# EAGLE design modularduino (EAGLE 5.04)
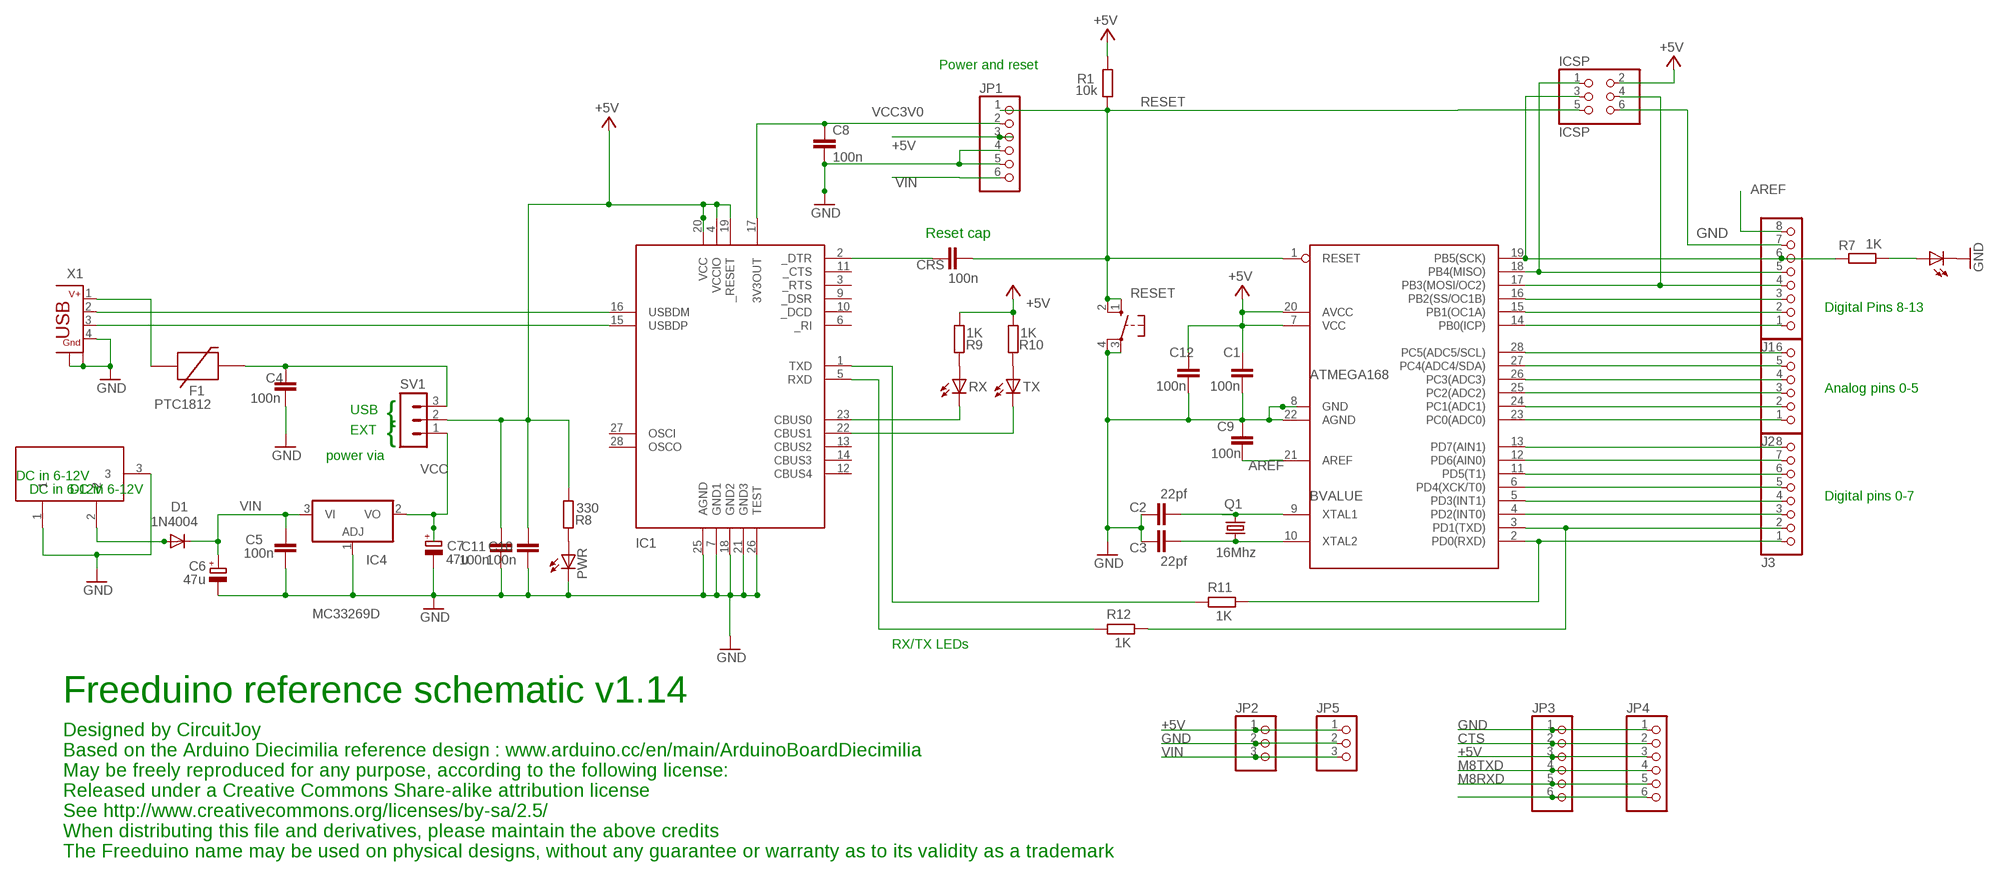
[diagram p0: schematic, sheet 1]

## Parts
BVALUE  ATMEGA168  MEGA8-P  [DIL28-3]
C1  100n  C-EUC1206  [C1206]
C2  22pf  C-EUC1206  [C1206]
C3  22pf  C-EUC1206  [C1206]
C4  100n  C-EUC1206  [C1206]
C5  100n  C-EUC1206  [C1206]
C6  47u  CPOL-EUD  [PANASONIC_D]
C7  47u  CPOL-EUD  [PANASONIC_D]
C8  100n  C-EUC1206  [C1206]
C9  100n  C-EUC1206  [C1206]
C10  100n  C-EUC1206  [C1206]
C11  100n  C-EUC1206  [C1206]
C12  100n  C-EUC1206  [C1206]
CRS  100n  C-EUC1206  [C1206]
D1  1N4004  DIODESMA  [SMA-DIODE]
DC1  9V in  DC21MMX  [DC-21MM]
F1  PTC1812  [C1812]
IC1  FT232RL  FT232RL-PINNED  [SSOP28DB]
IC4  MC33269D  [DPACK]
ICSP  ICSP  PINHD-2X3  [2X03]
J1  PINHD-1X8  [1X08]
J2  PINHD-1X6  [1X06]
J3  PINHD-1X8  [1X08]
JP1  PINHD-1X6  [1X06]
JP2  PINHD-1X3  [1X03]
JP3  PINHD-1X6  [1X06]
JP4  PINHD-1X6  [1X06]
JP5  PINHD-1X3  [1X03]
P13  LED-LCC1206  [LCC1206]
PWR  LED-LCC1206  [LCC1206]
Q1  16Mhz  CRYSTALHC49U-V  [HC49U-V]
R1  10k  R-EU_R1206  [R1206]
R7  1K  R-EU_R1206  [R1206]
R8  330  R-EU_R1206  [R1206]
R9  1K  R-EU_R1206  [R1206]
R10  1K  R-EU_R1206  [R1206]
R11  1K  R-EU_R1206  [R1206]
R12  1K  R-EU_R1206  [R1206]
RESET  10-XX  [B3F-10XX]
RX  LED-LCC1206  [LCC1206]
SV1  MA03-1  [MA03-1]
TX  LED-LCC1206  [LCC1206]
X1  CON-USB-B  [USB-WSHIELDPADS]

## Nets
+5V [power]: BVALUE.7(VCC) BVALUE.20(AVCC) C1.1 C10.2 C11.2 C12.1 IC1.4(VCCIO) IC1.19(_RESET) IC1.20(VCC) ICSP.2 JP1.3 JP2.1 JP3.3 JP4.3 JP5.1 R1.2 R8.1 R9.1 R10.1 SV1.2
AREF: BVALUE.21(AREF) C9.1 J1.8
CRS [finepitch]: CRS.1 IC1.2(_DTR) JP3.6 JP4.6
CTS: JP3.2 JP4.2
GND [power]: BVALUE.8(GND) BVALUE.22(AGND) C1.2 C2.1 C3.1 C4.1 C5.1 C6.- C7.- C8.2 C9.2 C10.1 C11.1 C12.2 DC1.1 DC1.3 IC1.7(GND1) IC1.18(GND2) IC1.21(GND3) IC1.25(AGND) IC1.26(TEST) IC4.1(ADJ) ICSP.6 J1.7 JP1.4 JP1.5 JP2.2 JP3.1 JP4.1 JP5.2 P13.C PWR.C RESET.3(P) RESET.4(P1) X1.4 X1.SH1(GND) X1.SH2(GND)
M8RXD [finepitch]: IC1.1(TXD) JP3.5 JP4.5 R11.1
M8TXD [finepitch]: IC1.5(RXD) JP3.4 JP4.4 R12.1
N$2: BVALUE.15(PB1(OC1A)) J1.2
N$3: PWR.A R8.2
N$5 [finepitch]: IC1.23(CBUS0) RX.C
N$6: BVALUE.9(XTAL1) C2.2 Q1.2
N$7 [power]: C4.2 F1.2 SV1.3
N$9 [finepitch]: IC1.16(USBDM) X1.2
N$10: BVALUE.4(PD2(INT0)) J3.3
N$11: BVALUE.5(PD3(INT1)) J3.4
N$12: BVALUE.6(PD4(XCK/T0)) J3.5
N$13: BVALUE.11(PD5(T1)) J3.6
N$14: BVALUE.12(PD6(AIN0)) J3.7
N$15: BVALUE.13(PD7(AIN1)) J3.8
N$16: BVALUE.23(PC0(ADC0)) J2.1
N$17: BVALUE.24(PC1(ADC1)) J2.2
N$18: BVALUE.25(PC2(ADC2)) J2.3
N$19: BVALUE.26(PC3(ADC3)) J2.4
N$20: BVALUE.27(PC4(ADC4/SDA)) J2.5
N$21: BVALUE.28(PC5(ADC5/SCL)) J2.6
N$22: BVALUE.3(PD1(TXD)) J3.2 R12.2
N$23: BVALUE.16(PB2(SS/OC1B)) J1.3
N$24 [finepitch]: IC1.15(USBDP) X1.3
N$26: BVALUE.18(PB4(MISO)) ICSP.1 J1.5
N$28: BVALUE.14(PB0(ICP)) J1.1
N$29 [finepitch]: IC1.22(CBUS1) TX.C
N$31: BVALUE.10(XTAL2) C3.2 Q1.1
N$32: P13.A R7.1
N$34: R10.2 TX.A
N$36: R9.2 RX.A
N$43: BVALUE.17(PB3(MOSI/OC2)) ICSP.4 J1.4
N$44: BVALUE.2(PD0(RXD)) J3.1 R11.2
N$45: D1.A DC1.2
RESET: BVALUE.1(RESET) CRS.2 ICSP.5 JP1.1 R1.1 RESET.1(S) RESET.2(S1)
SCK: BVALUE.19(PB5(SCK)) ICSP.3 J1.6 R7.2
USBV+ [power]: F1.1 X1.1
VCC [power]: C7.+ IC4.2(VO) SV1.1
VCC3V0 [power]: C8.1 IC1.17(3V3OUT) JP1.2
VIN [power]: C5.2 C6.+ D1.C IC4.3(VI) JP1.6 JP2.3 JP5.3
Unconnected: IC1.3(_RTS) IC1.6(_RI) IC1.9(_DSR) IC1.10(_DCD) IC1.11(_CTS) IC1.12(CBUS4) IC1.13(CBUS2) IC1.14(CBUS3) IC1.27(OSCI) IC1.28(OSCO)

## Notes on the sheet
- Power and reset
- Reset cap
- Digital Pins 8-13
- Analog pins 0-5
- USB
- {
- EXT
- {
- power via
- DC in 6-12V
- DC in 6-12V | DC in 6-12V
- Digital pins 0-7
- RX/TX LEDs
- Freeduino reference schematic v1.14
- Designed by CircuitJoy
- Based on the Arduino Diecimilia reference design : www.arduino.cc/en/main/ArduinoBoardDiecimilia
- May be freely reproduced for any purpose, according to the following license:
- Released under a Creative Commons Share-alike attribution license
- See http://www.creativecommons.org/licenses/by-sa/2.5/
- When distributing this file and derivatives, please maintain the above credits
- The Freeduino name may be used on physical designs, without any guarantee or warranty as to its validity as a trademark

## Library data of the parts
BVALUE = my-library:MEGA8-P: MICROCONTROLLER 8 Kbytes FLASH 1 kbytes SRAM 512 bytes EEPROM USART 4-channel 10 bit ADC 2-channel 8 bit ADC Source: avr.lbr
C1-C5 C8-C12 CRS = rcl:C-EU: CAPACITOR, European symbol
C6 C7 = rcl:CPOL-EU: POLARIZED CAPACITOR, European symbol
D1 = SparkFunEagle-6-6-07:DIODE: Diode These are standard reverse protection diodes and small signal diodes. SMA package can handle up to about 1A. SOD-323 can handle about 200mA. What the SOD-323 package when ordering, there are some mfgs out there that are 5-pin packages.
DC1 = powersupply:DC21MM
F1 = SparkFunEagle-6-6-07:PTC: Resettable Fuse PTC Resettable Fuse. Spark Fun Electronics SKU : COM-08357
IC1 = my-library:FT232RL-PINNED: USB UART FT232RL 4th Generation USB UART (USB <-> Serial) Controller. Spark Fun Electronics SKU : COM-00650
IC4 = linear:MC33269?*: Adjustable Output Low Dropout Voltage Regulator 800 mA Source: http://www.onsemi.com/pub/Collateral/MC33269-D.PDF
ICSP = pinhead:PINHD-2X3: PIN HEADER
J1 J3 = pinhead:PINHD-1X8: PIN HEADER
J2 JP1 JP3 JP4 = pinhead:PINHD-1X6: PIN HEADER
JP2 JP5 = pinhead:PINHD-1X3: PIN HEADER
P13 PWR RX TX = my-led:LED: LED OSRAM: - CHIPLED LG R971, LG N971, LY N971, LG Q971, LY Q971, LO R971, LY R971 LH N974, LH R974 LS Q976, LO Q976, LY Q976 LO Q996 - Hyper CHIPLED LW Q18S LB Q993, LB Q99A, LB R99A - SideLED LS A670, LO A670, LY A670, LG A670, LP A670 LB A673, LV A673, LT A673, LW A673 LH A674 LY A675 LS A676, LA A676, LO A676, LY A676, LW A676 LS A679, LY A679, LG A679 - Hyper Micro SIDELED® LS Y876, LA Y876, LO Y876, LY Y876 LT Y87S - SmartLED LW L88C, LW L88S LB L89C, LB L89S, LG L890 LS L89K, LO L89K, LY L89K LS L896, LA L896, LO L896, LY L896 - TOPLED LS T670, LO T670, LY T670, LG T670, LP T670 LSG T670, LSP T670, LSY T670, LOP T670, LYG T670 LG T671, LOG T671, LSG T671 LB T673, LV T673, LT T673, LW T673 LH T674 LS T676, LA T676, LO T676, LY T676, LB T676, LH T676, LSB T676, LW T676 LB T67C, LV T67C, LT T67C, LS T67K, LO T67K, LY T67K, LW E67C LS E67B, LA E67B, LO E67B, LY E67B, LB E67C, LV E67C, LT E67C LW T67C LS T679, LY T679, LG T679 LS T770, LO T770, LY T770, LG T770, LP T770 LB T773, LV T773, LT T773, LW T773 LH T774 LS E675, LA E675, LY E675, LS T675 LS T776, LA T776, LO T776, LY T776, LB T776 LHGB T686 LT T68C, LB T68C - Hyper Mini TOPLED® LB M676 - Mini TOPLED Santana® LG M470 LS M47K, LO M47K, LY M47K Source: http://www.osram.convergy.de/
Q1 = crystal:CRYSTAL: CRYSTAL
R1 R7-R12 = rcl:R-EU_: RESISTOR, European symbol
RESET = switch-omron:10-XX: OMRON SWITCH
SV1 = con-lstb:MA03-1: PIN HEADER
X1 = mylib4:CON-USB-B: BERG USB connector

## Net classes
0 default: width 0.254 mm, clearance 0.203 mm
1 power: width 0.508 mm, clearance 0.305 mm
2 finepitch: width 0.203 mm, clearance 0.203 mm

## Board
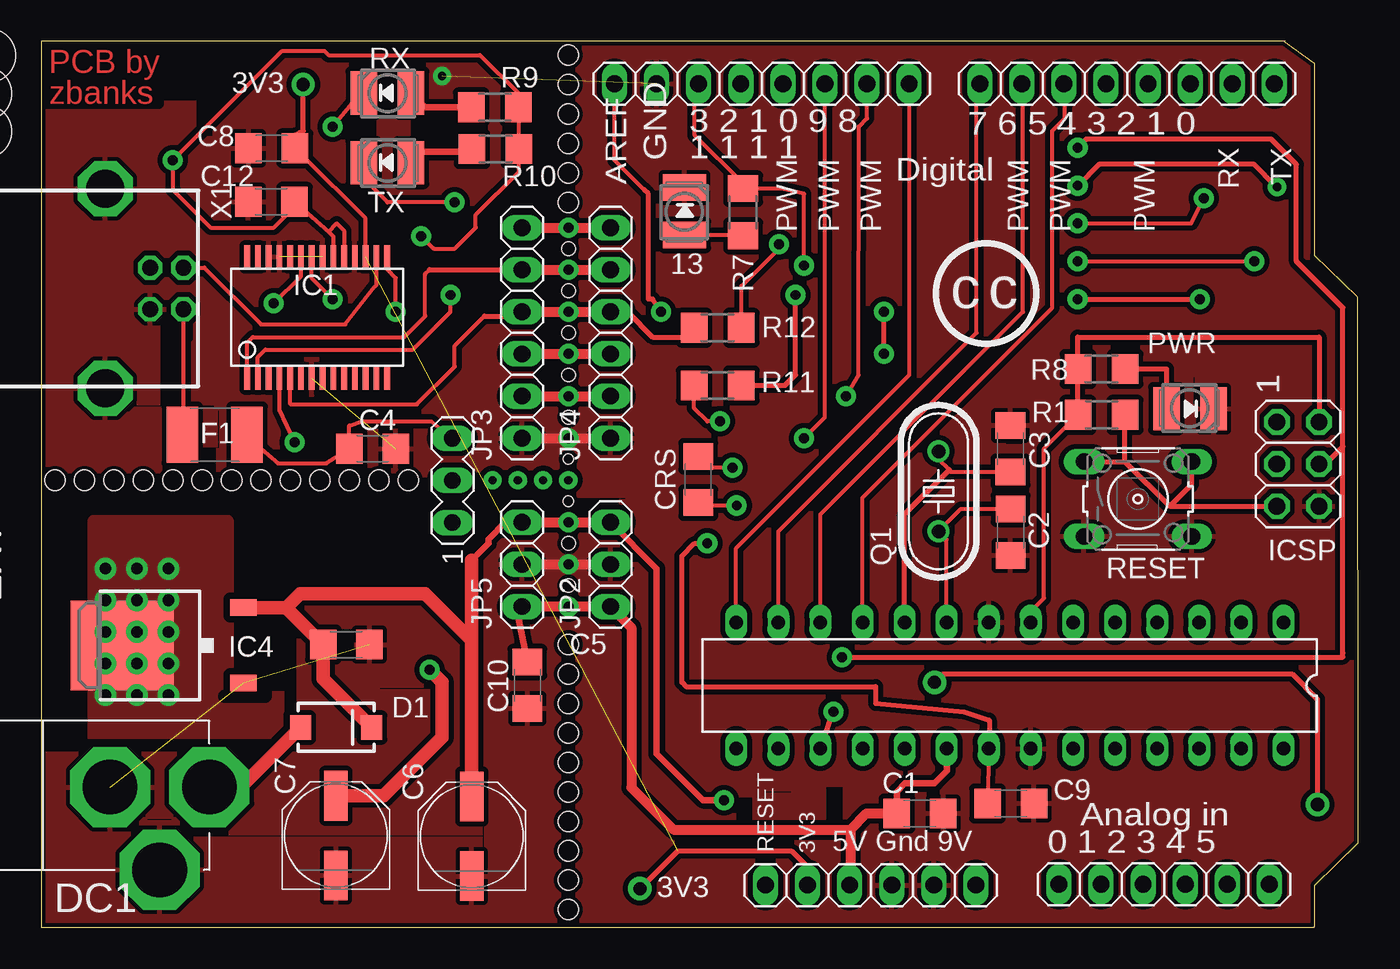
[diagram p1: board, top side]
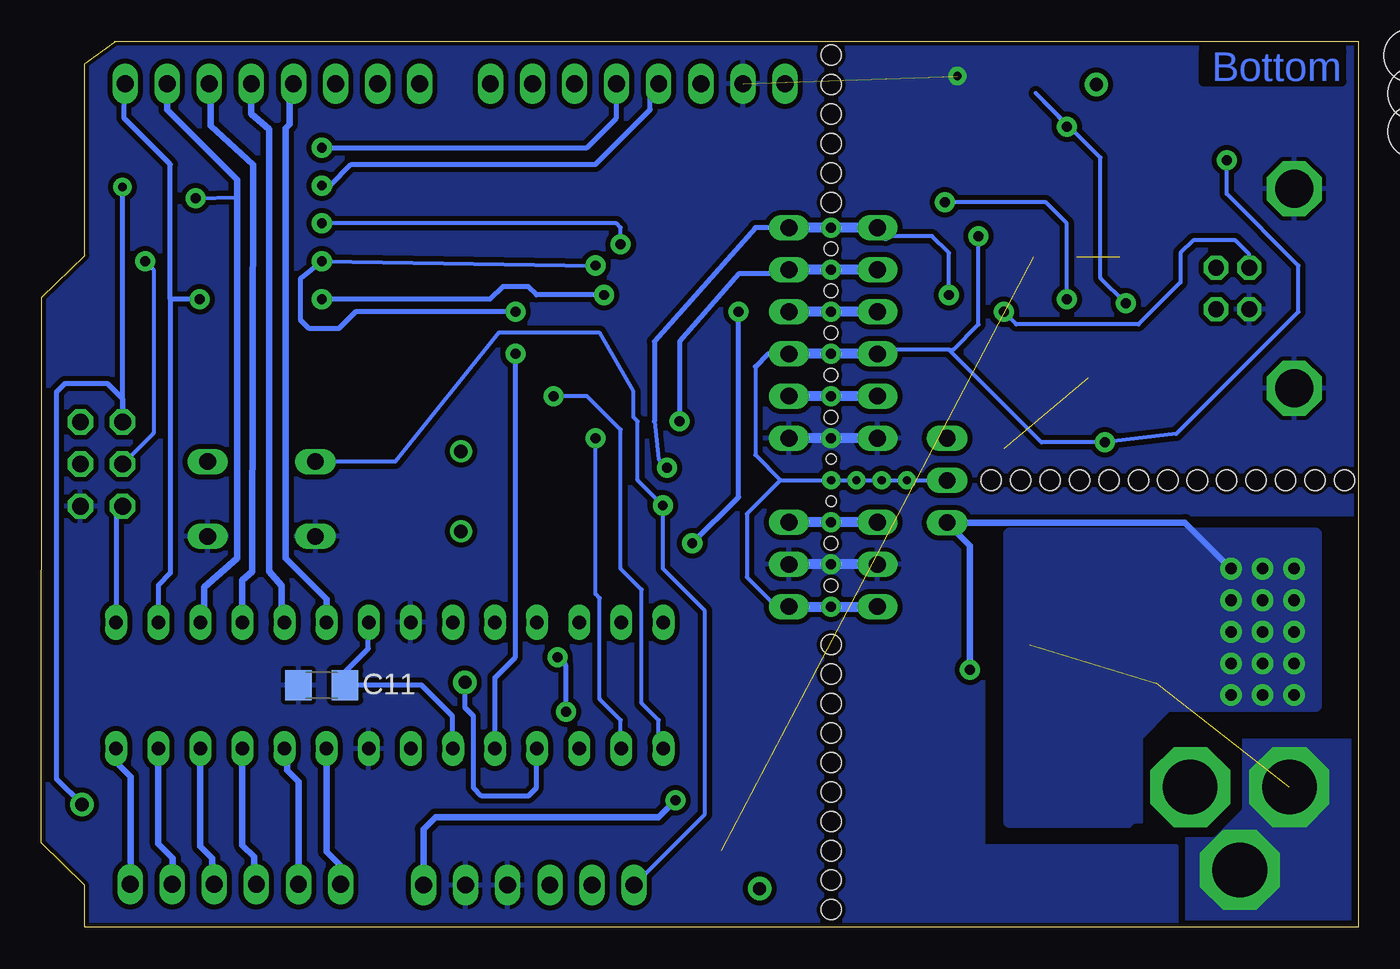
[diagram p2: board, bottom side, seen from below]

Size 79.46 x 53.44 mm. Coordinates in mm from the lower left corner, seen from the top.
Outline: 76.84,0.03 76.85,0.06 76.85,2.55 79.46,5.1
Outline: 76.85,40.54 76.85,52.09 75.02,53.44
Outline: 76.82,0.05 76.83,0 74.26,0.01 0,0.01 0,53.44 75.08,53.44
Outline: 79.46,5.11 79.45,38 76.8,40.54
Copper layers (1*16): Top 0.035mm / dielectric 1.5mm / Bottom 0.035mm
Design rules "default": minimum track width 10mil, minimum drill 0.6mm, track to track 8mil, track to pad 8mil, pad to pad 8mil, via to via 12mil, smd to smd 8mil, copper to edge 10mil, drill to drill 15mil, minimum pad ring 10mil, minimum via ring 12mil, stop-mask expansion 4mil, vias tented up to drill 0mil, thermal gap 10mil
Holes 3.2 mm at -3.17,52.59 -3.43,50.3 -3.43,48.02
Holes 1.2 mm at 0.81,26.97 2.59,26.97 4.37,26.97 6.15,26.97 7.92,26.97 9.7,26.97 11.48,26.97 13.26,26.97 15.04,26.97 16.81,26.97 18.59,26.97 20.37,26.97 22.15,26.97 31.8,1.06 31.8,2.84 31.8,4.62 31.8,6.4 31.8,8.17 31.8,9.95 31.8,11.73 31.8,13.51 31.8,15.29 31.8,17.06 31.8,43.73 31.8,45.51 31.8,47.29 31.8,49.07 31.8,50.85 31.8,52.62
Holes 0.8 mm at 31.8,20.62 31.8,23.16 31.8,40.94 31.8,38.4 31.8,35.86 31.8,33.32 31.8,30.78
Holes 0.6 mm at 31.8,25.7 31.8,28.24
tRestrict: area 26.8,41.2 to 27.8,43.1; area 26.9,23.8 to 27.8,25.7; area 33.9,23.7 to 34.8,25.6; area 19.3,46.8 to 20.2,48.7; area 9.4,47.7 to 10.3,49.7; area 58.2,29.2 to 59.2,31.1; area 13.1,14.7 to 15,15.6; area 14.2,27.9 to 16.1,28.8; area 17.9,16.1 to 18.8,18; area 46.9,28.4 to 48.8,29.4; area 46.9,23.3 to 48.8,24.3; area 47.4,6.5 to 48.3,8.4; 2 more areas; 32 lines
bRestrict: 3 lines

### Footprints (pad centres in the part's own frame; a part is rotated, then mirrored left to right if it is on the bottom)
DIL28-3 = drill 0.813 long: 1 -16.51,-3.81; 2 -13.97,-3.81; 3 -11.43,-3.81; 4 -8.89,-3.81; 5 -6.35,-3.81; 6 -3.81,-3.81; 7 -1.27,-3.81; 8 1.27,-3.81; 9 3.81,-3.81; 10 6.35,-3.81; 11 8.89,-3.81; 12 11.43,-3.81; 13 13.97,-3.81; 14 16.51,-3.81; 15 16.51,3.81; 16 13.97,3.81; 17 11.43,3.81; 18 8.89,3.81; 19 6.35,3.81; 20 3.81,3.81; 21 1.27,3.81; 22 -1.27,3.81; 23 -3.81,3.81; 24 -6.35,3.81; 25 -8.89,3.81; 26 -11.43,3.81; 27 -13.97,3.81; 28 -16.51,3.81
C1206 = smd 1.6 x 1.8: 1 -1.4,0; 2 1.4,0
PANASONIC_D = smd 3 x 1.4: + 2.4,0; - -2.4,0
SMA-DIODE = smd 1.27 x 1.47: A -2.15,0; C 2.15,0
DC-21MM = drill 3.302 pad 4.826 octagon: 1 -5.08,-3.353; 2 -0.076,-6.35; 3 -0.076,-0.356
C1812 = smd 1.9 x 3.4: 1 -1.95,0; 2 1.95,0
SSOP28DB = smd 0.348 x 1.397: 1 -4.225,-3.656; 2 -3.575,-3.656; 3 -2.925,-3.656; 4 -2.275,-3.656; 5 -1.625,-3.656; 6 -0.975,-3.656; 7 -0.325,-3.656; 8 0.325,-3.656; 9 0.975,-3.656; 10 1.625,-3.656; 11 2.275,-3.656; 12 2.925,-3.656; 13 3.575,-3.656; 14 4.225,-3.656; 15 4.225,3.656; 16 3.575,3.656; 17 2.925,3.656; 18 2.275,3.656; 19 1.625,3.656; 20 0.975,3.656; 21 0.325,3.656; 22 -0.325,3.656; 23 -0.975,3.656; 24 -1.625,3.656; 25 -2.275,3.656; 26 -2.925,3.656; 27 -3.575,3.656; 28 -4.225,3.656
DPACK = smd 1 x 1.6: 1 -2.28,-4.8; 3 2.28,-4.8 | smd 5.4 x 6.2: 2 0,2.5
2X03 = drill 1.016 octagon: 1 -2.54,-1.27; 2 -2.54,1.27; 3 0,-1.27; 4 0,1.27; 5 2.54,-1.27; 6 2.54,1.27
1X08 = drill 1.016 long: 1 -8.89,0; 2 -6.35,0; 3 -3.81,0; 4 -1.27,0; 5 1.27,0; 6 3.81,0; 7 6.35,0; 8 8.89,0
1X06 = drill 1.016 long: 1 -6.35,0; 2 -3.81,0; 3 -1.27,0; 4 1.27,0; 5 3.81,0; 6 6.35,0
1X03 = drill 1.016 long: 1 -2.54,0; 2 0,0; 3 2.54,0
LCC1206 = smd 2.6 x 1.6: A -0.025,1.375; C -0.025,-1.475
HC49U-V = drill 0.813 round: 1 -2.413,0; 2 2.413,0
R1206 = smd 1.6 x 1.803: 1 -1.422,0; 2 1.422,0
B3F-10XX = drill 1.016 long: 1 -3.251,2.261; 2 3.251,2.261; 3 -3.251,-2.261; 4 3.251,-2.261
MA03-1 = drill 1.016 long: 1 -2.54,0; 2 0,0; 3 2.54,0
USB-WSHIELDPADS = drill 0.95 octagon: 1 1.25,4.71; 2 -1.25,4.71; 3 -1.25,2.71; 4 1.25,2.71 | drill 2.3 octagon: SH1 -6.02,0; SH2 6.02,0

### Placement (x,y rotation side)
BVALUE  58.44,14.59 180 top
C1  53.02,6.87 0 top
C2  58.49,23.84 90 top
C3  58.48,28.87 270 top
C4  19.98,28.87 180 top
C5  18.4,17.06 180 top
C6  25.97,5.49 90 top
C7  17.77,5.53 90 top
C8  13.9,47 180 top
C9  58.5,7.47 0 top
C10  29.33,14.6 90 top
C11  62.54,14.61 0 bottom
C12  13.88,43.77 180 top
CRS  39.64,27.01 270 top
D1  17.78,12.06 0 top
DC1  3.78,8.54 90 top
F1  10.45,29.71 0 top
IC1  16.64,36.79 0 top
IC4  7.38,17 90 top
ICSP  75.83,27.95 270 top
J1  43.47,50.88 180 top
J2  67.76,2.6 0 top
J3  65.52,50.88 180 top
JP1  50.05,2.55 0 top
JP2  34.34,21.89 90 top
JP3  29.01,35.86 90 top
JP4  34.34,35.86 90 top
JP5  29.01,21.89 90 top
P13  38.8,43.14 180 top
PWR  69.27,31.32 90 top
Q1  54.14,26.3 270 top
R1  63.98,30.92 180 top
R7  42.34,43.14 90 top
R8  63.98,33.68 0 top
R9  27.36,49.47 180 top
R10  27.4,46.95 180 top
R11  40.81,32.69 0 top
R12  40.81,36.17 0 top
RESET  66.17,25.84 0 top
RX  20.92,50.31 270 top
SV1  24.8,26.96 90 top
TX  20.92,46.11 270 top
U$3  [CC-LOGO]  57.91,38.84 0 top
X1  3.86,38.54 270 top

### Tracks (layer width: path | path; a pad name or v marks a point on that pad's centre or on a via)
+5V  (via drill 0.5, 0.6)
  Top 0.254: IC1.20 17.61,41.69 17.33,41.97 | 17.33,41.97 C12.1 15.04,43.78 15.04,43.23 14.02,42.21 10.21,42.21 7.92,44.5 v7.92,46.27 14.53,52.88 17.07,52.88 17.32,52.62 26.47,52.62 28.78,50.31 R9.1 28.78,46.99 28.78,45.54 26.21,42.97 26.21,42.21 24.94,40.94 23.67,40.94 v22.91,41.7 | IC1.19 18.26,42.03 17.83,42.46 | 17.83,42.46 | 17.33,41.97 17.83,42.46 | R1.2 60.5,28.86 60.5,19.86 59.71,19.07 BVALUE.7 | IC1.4 14.36,31.2 v15.29,29.26
  Top 0.305: R1.2 R8.1 62.53,33.68 62.53,35.61 77.1,35.61 ICSP.2
  Top 0.406: 28.78,46.99 R10.1 | 28.71,19.05 C10.2 | C1.1 51.62,8.18 52.12,8.68 53.9,8.68 54.66,9.44 54.66,10.75 BVALUE.20
  Top 0.61: JP3.3 v31.8,34.59 JP4.3 | 28.71,19.05 JP5.1 v31.8,19.35 JP2.1 35.61,18.08 35.61,8.43 38.15,5.89 48.82,5.89 | C1.1 49.8,6.87 48.82,5.89 | 48.82,5.89 48.82,2.59 JP1.3
  Bottom 0.254: v22.91,41.7 22.91,36.37 24.43,34.84 24.69,34.84 | v7.92,46.27 7.92,44.24 3.61,39.92 3.61,37.13 10.97,29.76 v15.29,29.26 19.1,29.26 24.69,34.84 | 24.69,34.84 28.75,34.84 | 36.37,33.83 36.37,28.49 34.85,26.97 | 34.85,26.97 v31.8,26.97 v30.28,26.97 v28.75,26.97 v27.23,26.97 25.07,26.97 SV1.2 | 35.1,19.35 36.88,21.13 36.88,24.94 34.85,26.97
  Bottom 0.305: JP4.3 35.61,34.59 36.37,33.83 | BVALUE.7 59.74,18.37 59.74,16.81 61.14,15.41 C11.2 56.52,14.61 54.66,12.75 54.66,10.81 BVALUE.20
  Bottom 0.61: JP3.3 v31.8,34.59 | v31.8,34.59 JP4.3 v31.8,34.59 | JP5.1 v31.8,19.35 JP2.1 35.1,19.35 | 28.75,34.84 JP3.3 | JP3.3 v31.8,34.59
AREF  (via drill 0.6)
  Top 0.254: BVALUE.21 C9.1 | J1.8 34.58,46.28 36.37,44.5
  Top 0.305: 36.37,44.5 36.63,44.24 36.63,37.89 36.88,37.89 v37.39,37.13 | v40.18,23.16 39.42,23.16 38.66,22.4 38.66,14.78 38.91,14.52 50.34,14.52 50.34,13.51 55.68,13 57.2,12.49 57.2,10.81 BVALUE.21
  Bottom 0.305: v37.39,37.13 37.39,25.95 v40.18,23.16 | BVALUE.21 56.95,11
CRS  (via drill 0.6)
  Top 0.254: IC1.2 13.06,34.4 13.51,34.84 22.4,34.84 24.69,37.13 v24.69,38.15 | v41.71,27.73 40.32,27.73 CRS.1
  Top 0.61: JP3.6 v31.8,42.21 34.59,42.21
  Bottom 0.254: v24.69,38.15 24.69,40.69 25.7,41.7 28.5,41.7 | 42.47,30.53 42.21,28.24 v41.71,27.73
  Bottom 0.305: JP4.6 36.37,42.21 42.47,35.35 42.47,30.53
  Bottom 0.61: 28.5,41.7 JP3.6 v31.8,42.21 JP4.6
CTS  (via drill 0.6)
  Top 0.61: JP3.2 v31.8,32.05 JP4.2
  Bottom 0.61: JP3.2 v31.8,32.05 JP4.2
GND  (via drill 0.5, 0.6)  (5 unrouted)
  Top 0.61: JP3.1 v31.8,29.51 JP4.1 | JP5.2 v31.8,21.89 JP2.2
  Bottom 0.61: JP3.1 v31.8,29.51 JP4.1 | JP5.2 v31.8,21.89 JP2.2
  other vias: 24.18,51.35
  pour Bottom (isolate 0.4, rank 5, no thermals): -0.64,11.07 10.15,11.07 10.15,-0.83 -0.64,-0.83 -0.64,10.9
  pour Top: -0.2,54.91 81.08,54.91 81.08,-1.73 -0.2,-1.73 -0.2,10.46 15.54,10.46 15.54,25.45 -0.2,25.45
  pour Bottom: -0.2,54.91 81.08,54.91 81.08,-1.73 -0.2,-1.73 -0.2,-0.46 10.97,-0.46 10.97,4.87 22.66,4.87 22.66,24.94 -0.2,24.94
M8RXD  (via drill 0.6)
  Top 0.254: IC1.1 12.41,35.27 12.75,35.61 21.89,35.61 23.16,36.88 23.16,39.42 23.42,39.67 | R11.1 39.39,31.32 40.18,30.53 v40.94,30.53 41.2,30.53
  Top 0.305: 23.42,39.67 JP3.5
  Top 0.61: JP3.5 v31.8,39.67 34.59,39.67
  Bottom 0.305: 34.59,39.42 37.39,39.42 40.94,35.35 v40.94,30.53
  Bottom 0.61: JP3.5 v31.8,39.67 JP4.5 34.59,39.42
M8TXD  (via drill 0.6)
  Top 0.254: IC1.5 15.01,31.56 17.58,31.54 22.66,31.54 24.94,33.83 24.94,35.1 26.72,36.88
  Top 0.305: 26.72,36.88 29.26,36.88 | R12.1 38.83,35.61 36.88,35.61 35.36,37.13 JP4.4
  Top 0.61: 29.51,37.13 JP3.4 | 29.51,37.13 v31.8,37.13 JP4.4 | 29.26,36.88 29.51,37.13
  Bottom 0.61: JP3.4 v31.8,37.13 JP4.4
N$2  (via drill 0.6)
  Top 0.254: J1.2 49.82,48.8 49.33,48.31 49.32,33.31 v48.56,32.05
  Bottom 0.254: v48.56,32.05 46.53,32.05 44.5,30.02 44.5,21.64 43.23,20.37 43.23,13.51 42.21,12.49 42.21,11.06 BVALUE.15
N$3
  Top 0.305: R8.2 67.89,33.68 PWR.A
N$5  (via drill 0.6)
  Top 0.254: IC1.23 15.66,39.28 v14.02,37.64 | v17.58,48.31 19.35,50.42 RX.C
  Bottom 0.254: v14.02,37.64 15.54,39.16 15.54,46.43 RX.C 17.67,48.47 v17.58,48.31
N$6
  Top 0.254: BVALUE.9 54.63,23.4 Q1.2 55.49,25.24 C2.2
N$7
  Top 0.254: F1.2 12.4,29.6 14.27,27.99 17.19,27.99 C4.2 18.58,30.26 19.35,30.53 23.52,30.53 SV1.3
N$8  (via drill 0.8)
  Top 0.305: v15.8,50.85 15.8,48.05 15.29,47.8 15.29,46.78
N$9
  Top 0.254: X1.2 9.83,39.79 13.26,36.37 18.34,36.37 20.12,38.65 20.21,38.75 IC1.16
N$10
  Bottom 0.406: BVALUE.4 67.33,20.92 66.74,21.45 66.67,45.99 69.24,48.37 69.24,50.8 J3.3
N$11
  Bottom 0.406: J3.4 66.79,49.09 65.7,48.13 65.7,21.47 64.96,20.6 64.96,18.57 BVALUE.5
N$12
  Bottom 0.406: BVALUE.6 62.25,19.79 64.72,22.26 64.72,48.21 64.48,48.45 64.48,50.65 J3.5
N$13
  Top 0.254: BVALUE.11 49.55,25.92 61.01,37.38 61.01,48.05 61.77,48.81 61.77,50.82 J3.6
N$14
  Top 0.254: BVALUE.12 47.01,24.91 59.23,37.13 59.23,50.82 J3.7
N$15
  Top 0.254: BVALUE.13 44.47,23.89 56.44,35.86 56.44,50.69 J3.8
N$16
  Bottom 0.406: BVALUE.23 62.25,4.56 61.47,3.77 61.47,2.66 J2.1
N$17
  Bottom 0.406: J2.2 63.95,8.79 64.64,9.49 64.64,10.63 BVALUE.24
N$18
  Bottom 0.406: BVALUE.25 67.33,4.96 66.63,4.25 66.63,2.74 J2.3
N$19
  Bottom 0.406: BVALUE.26 69.87,4.88 69.16,4.17 69.16,2.74 J2.4
N$20
  Bottom 0.406: BVALUE.27 72.41,5.04 71.54,4.17 71.54,2.62 J2.5
N$21
  Bottom 0.406: BVALUE.28 74.95,9.96 74.08,9.09 74.08,2.62 J2.6
N$22  (via drill 0.6)
  Top 0.254: R12.2 42.24,38.68 44.5,40.94 v44.5,41.19 | v62.53,42.46 69.39,42.46 v70.15,43.99
  Bottom 0.254: v44.5,41.19 44.5,42.21 44.75,42.46 v62.53,42.46 | v70.15,43.99 67.64,44.05
  Bottom 0.406: J3.2 71.87,49.33 67.64,45.1 67.64,44.05 67.64,22.26 69.64,20.52 69.64,18.63 BVALUE.3
N$23  (via drill 0.6)
  Top 0.254: J1.3 47.28,30.77 v46.02,29.51
  Bottom 0.254: v46.02,29.51 46.02,20.11 45.77,19.86 45.77,13.76 44.5,12.49 44.5,10.81 BVALUE.16
N$24  (via drill 0.6)
  Top 0.254: v21.39,37.13 21.39,39.16 20.88,39.67 20.88,40.43 IC1.15
  Bottom 0.254: X1.3 6.57,40.6 7.42,41.45 9.96,41.45 10.72,40.69 10.72,38.91 13.26,36.37 20.62,36.37 v21.39,37.13
N$26  (via drill 0.5, 0.6, 0.8)
  Top 0.305: 74.47,44.75 73.2,46.02 63.8,46.02 v62.53,44.75 | 74.47,44.75 v74.56,44.66 74.56,44.75 74.47,44.75 | v77.01,7.41 77.01,13.76 75.49,15.29 54.41,15.29 v53.9,14.78
  Bottom 0.305: v62.53,44.75 62.03,44.75 60.76,46.02 46.02,46.02 42.72,49.32 42.72,50.37 J1.5 | v77.01,7.41 78.54,8.94 78.54,32.3 78.03,32.81 75.49,32.81 74.56,31.89 ICSP.1 v74.56,44.66 | v53.9,14.78 53.9,13.25 53.39,12.75 53.39,8.43 52.88,7.92 50.09,7.92 49.58,8.43 49.58,10.78 BVALUE.18
N$28
  Top 0.254: BVALUE.14 41.93,22.88 52.37,33.32 52.37,50.87 J1.1
N$29  (via drill 0.6)
  Top 0.254: IC1.22 16.31,39.15 v17.58,37.89 | v24.94,43.73 20.88,43.73 19.1,45.51 19.1,45.78 TX.C
  Bottom 0.254: v17.58,37.89 17.58,42.46 18.85,43.73 v24.94,43.73
N$31
  Top 0.254: Q1.1 54.14,28.25 54.79,27.6 54.91,27.48 C3.2
  Top 0.305: BVALUE.10 52.09,24.91 54.79,27.6
N$32
  Top 0.254: P13.A 42.29,41.77 R7.1
N$34
  Top 0.406: TX.A 22.3,46.42 22.66,46.78 25.8,46.78 R10.2
N$36
  Top 0.406: R9.2 23.16,49.47 RX.A
N$43  (via drill 0.6)
  Top 0.305: ICSP.4 77.48,27.95 78.54,29 | 78.54,29 78.54,16.56 78.54,16.3 v48.31,16.3 | 78.54,29 78.54,37.38 75.74,40.18 75.74,46.02 74.22,47.54 63.04,47.54 v62.53,47.04 | BVALUE.17 47.77,12.97 v47.8,13
  Bottom 0.305: v62.53,47.04 46.53,47.04 44.75,48.81 44.75,50.87 J1.4 | v47.8,13 47.8,15.79 v48.31,16.3
N$44  (via drill 0.6)
  Top 0.305: R11.2 44.88,32.69 45.52,33.32 v45.52,38.15 | v62.53,37.89 v69.9,37.89
  Bottom 0.305: BVALUE.2 72.41,20.65 71.68,21.38 71.68,37.89 | 71.68,37.89 71.68,46.02 74.47,48.81 74.47,50.82 J3.1 | v45.52,38.15 49.58,38.15 50.09,38.65 51.61,38.65 52.37,37.89 v62.53,37.89 | v69.9,37.89 71.68,37.89
N$45
  Top 0.813: DC1.2 12.04,8.46 D1.A
RESET  (via drill 0.6)
  Top 0.254: v41.96,25.45 39.81,25.45 CRS.2
  Top 0.305: RESET.1 65.4,28.1 | 65.4,28.1 R1.1 | 68.09,25.41 ICSP.5 | 65.4,28.1 68.09,25.41 | RESET.2 69.43,26.74 68.09,25.41
  Bottom 0.254: RESET.1 58.1,28.1 51.87,35.86 45.77,35.86 43.74,32.3 43.74,30.78 43.48,30.53 43.48,26.97 v41.96,25.45 41.96,21.64 39.42,19.1 39.42,6.83 JP1.1
  Bottom 0.305: BVALUE.1 74.95,25.02 ICSP.5
SCK  (via drill 0.6)
  Top 0.254: J1.6 39.42,50.64 39.42,47.8 42.34,44.87 R7.2 44.69,44.56 46.02,44.24 v46.02,39.92 | v62.53,40.18 v73.2,40.18
  Top 0.305: v50.85,34.59 v50.85,37.13
  Bottom 0.254: v62.53,40.18 v46.02,39.92 | v73.2,40.18 72.69,39.67 72.69,29.82 ICSP.3
  Bottom 0.305: BVALUE.19 52.09,15.06 50.85,16.3 v50.85,34.59 | v50.85,37.13 60.5,37.13 61.52,36.11 63.3,36.11 63.8,36.62 63.8,39.16 v62.53,40.18
USBV+
  Top 0.254: X1.1 8.57,30.64 8.94,30.27 8.94,30.04 F1.1
VCC  (via drill 0.6, 0.7)
  Top 0.813: C7.+ 20.64,7.93 24.18,11.48 24.18,14.78 v23.42,15.54
  Bottom 0.406: v23.42,15.54 23.42,23.03 SV1.1 10.45,24.42 v7.67,21.64
  other vias: 3.86,21.64 5.77,21.64 7.67,14.02 3.86,19.73 5.77,19.73 7.67,19.73 5.77,15.92 3.86,17.83 5.77,17.83 3.86,15.92 7.67,17.83 7.67,15.92 5.77,14.02 3.86,14.02
  pour Top (isolate 0.4, no thermals): 3.11,24.58 11.29,24.58 11.29,15.6 14.33,15.6 14.3,8.14 3.11,8.14
  pour Bottom (isolate 0.4, rank 2, no thermals): 2.59,23.7 2.59,13.38 11.53,13.38 13.38,11.53 13.39,6.4 21.01,6.4 21.01,23.7
VCC3V0  (via drill 0.8)  (1 unrouted)
  Top 0.254: IC1.17 19.56,42.76 15.8,46.53 15.77,46.53 C8.1
  Top 0.305: JP1.2 46.24,3.64 45.26,4.62 38.4,4.62 v36.12,2.33
VIN  (via drill 0.6)
  Top 0.406: 25.97,22.16 26.97,23.16 26.97,23.41 27.99,24.43 | v41.2,7.67 39.93,7.67 37.13,10.46 37.13,21.64 JP2.3
  Top 0.61: JP2.3 v31.8,24.43 JP5.3 27.99,24.43
  Top 0.813: 14.77,19.29 IC4.3 | 14.77,19.29 C5.2 17,14.99 D1.C | 25.97,22.16 C6.+ 25.97,17.3 23.16,20.11 15.6,20.11 14.77,19.29
  Bottom 0.406: JP1.6 56.4,5.93 55.68,6.65 42.21,6.65 v41.2,7.67
  Bottom 0.61: JP5.3 v31.8,24.43 JP2.3

### Text on the board
Top: PCB by | zbanks
Bottom: Bottom
tNames: 3V3 | 3 2 1 0 9 8 | 7 6 5 4 3 2 1 0 | RX | TX | GND | 1 1 1 1 | AREF | Digital | PWM | PWM | PWM | PWM | PWM | PWM | 13 | 1 | USB | EXT | Analog in | 5V Gnd 9V | RESET | 3V3 | 0 1 2 3 4 5 | 3V3
Edit History: 20070908 WestfW: Fix Analog-In silk. Keep traces away from holes. | 20070908 WestfW: Play with silkscreen. Add PWM labels, etc. | 20070908 WestfW: Update sch and filenames to 1.14. Clean up silkscreen | 20070907 WestfW: Reverse USB connector pinout. Add hole for resonator | 20070906 WestfW: Convert SMT parts to 0805 size | 20070906 WestfW: Additional copper for VR heatsink. | 20070906 WestfW: Add in Mounting holes. Additional bypass caps. | 20070904 WestfW: Rotate Crystal for GND Guard Ring, move some caps | 20070903 WestfW: Initial manual Route | 20070900 Daniel: Schematic and initial placement